# Altium schematic sheet Camera_Digital.SchDoc: Camera Digital
size A2; DrawnBy: Ian Glass; Address1: ECE Department; Address2: University of Canterbury; Address3: Christchurch 8041; Address4: New Zealand; Revision: 1; SheetNumber: 2; SheetTotal: 2; PageSetup: Record=PageOptions|CenterHorizontal=True|CenterVertical=True|PrintScale=0.71|XCorrection=1.00|YCorrection=1.00|PrintKind=1|BorderSize=5000000|LeftOffset=0|BottomOffset=0|Orientation=2|PaperLength=1000|PaperWidth=1000|Scale=100|PaperSource=15|PrintQuality=600|MediaType=1|DitherType=10|PaperKind=A3|PrintScaleMode=1
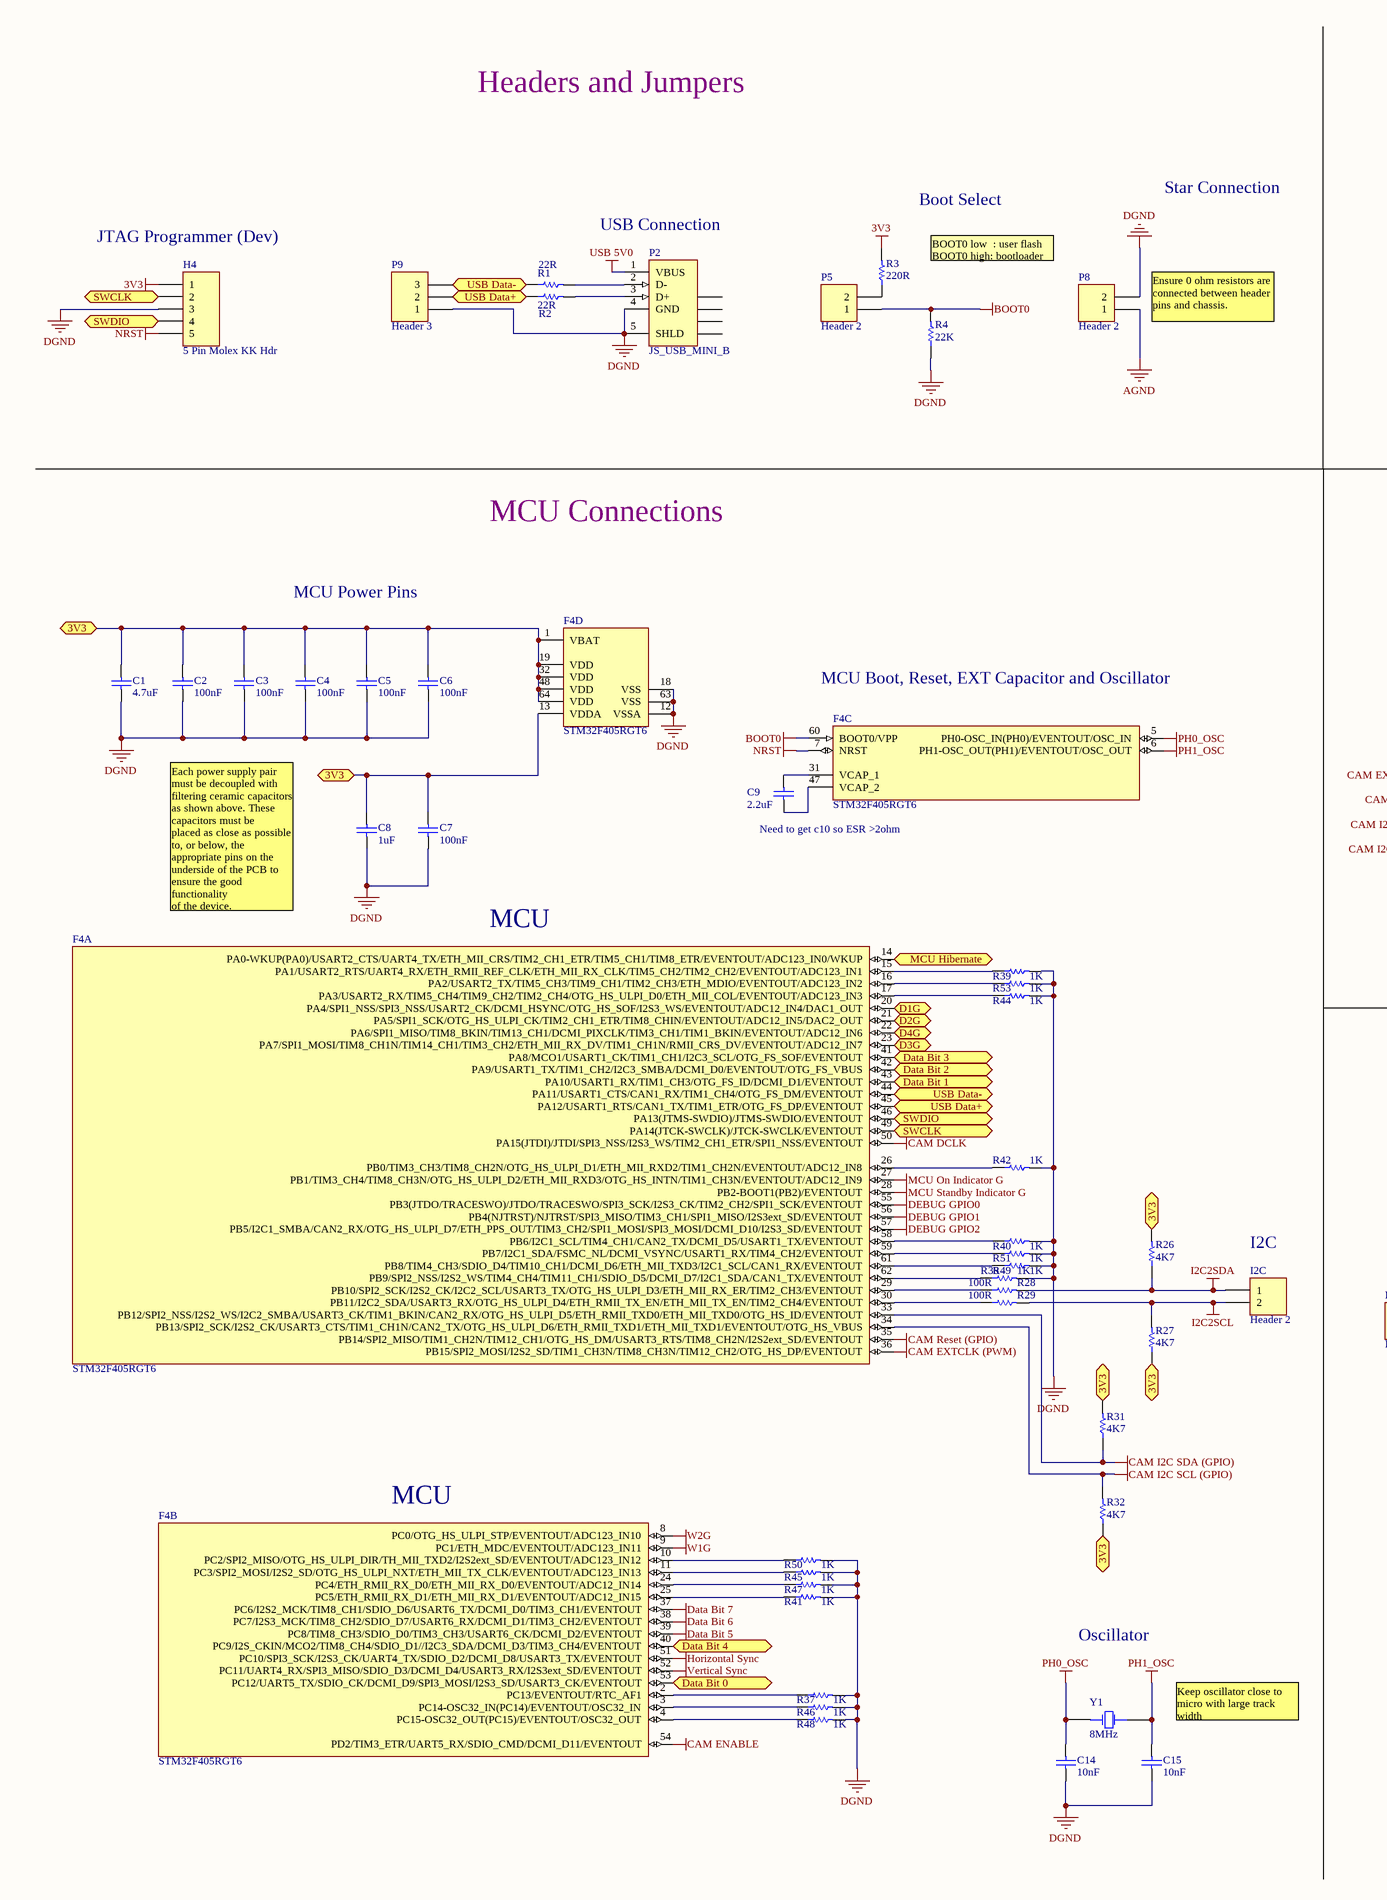
[diagram p0: Camera_Digital.SchDoc, left]
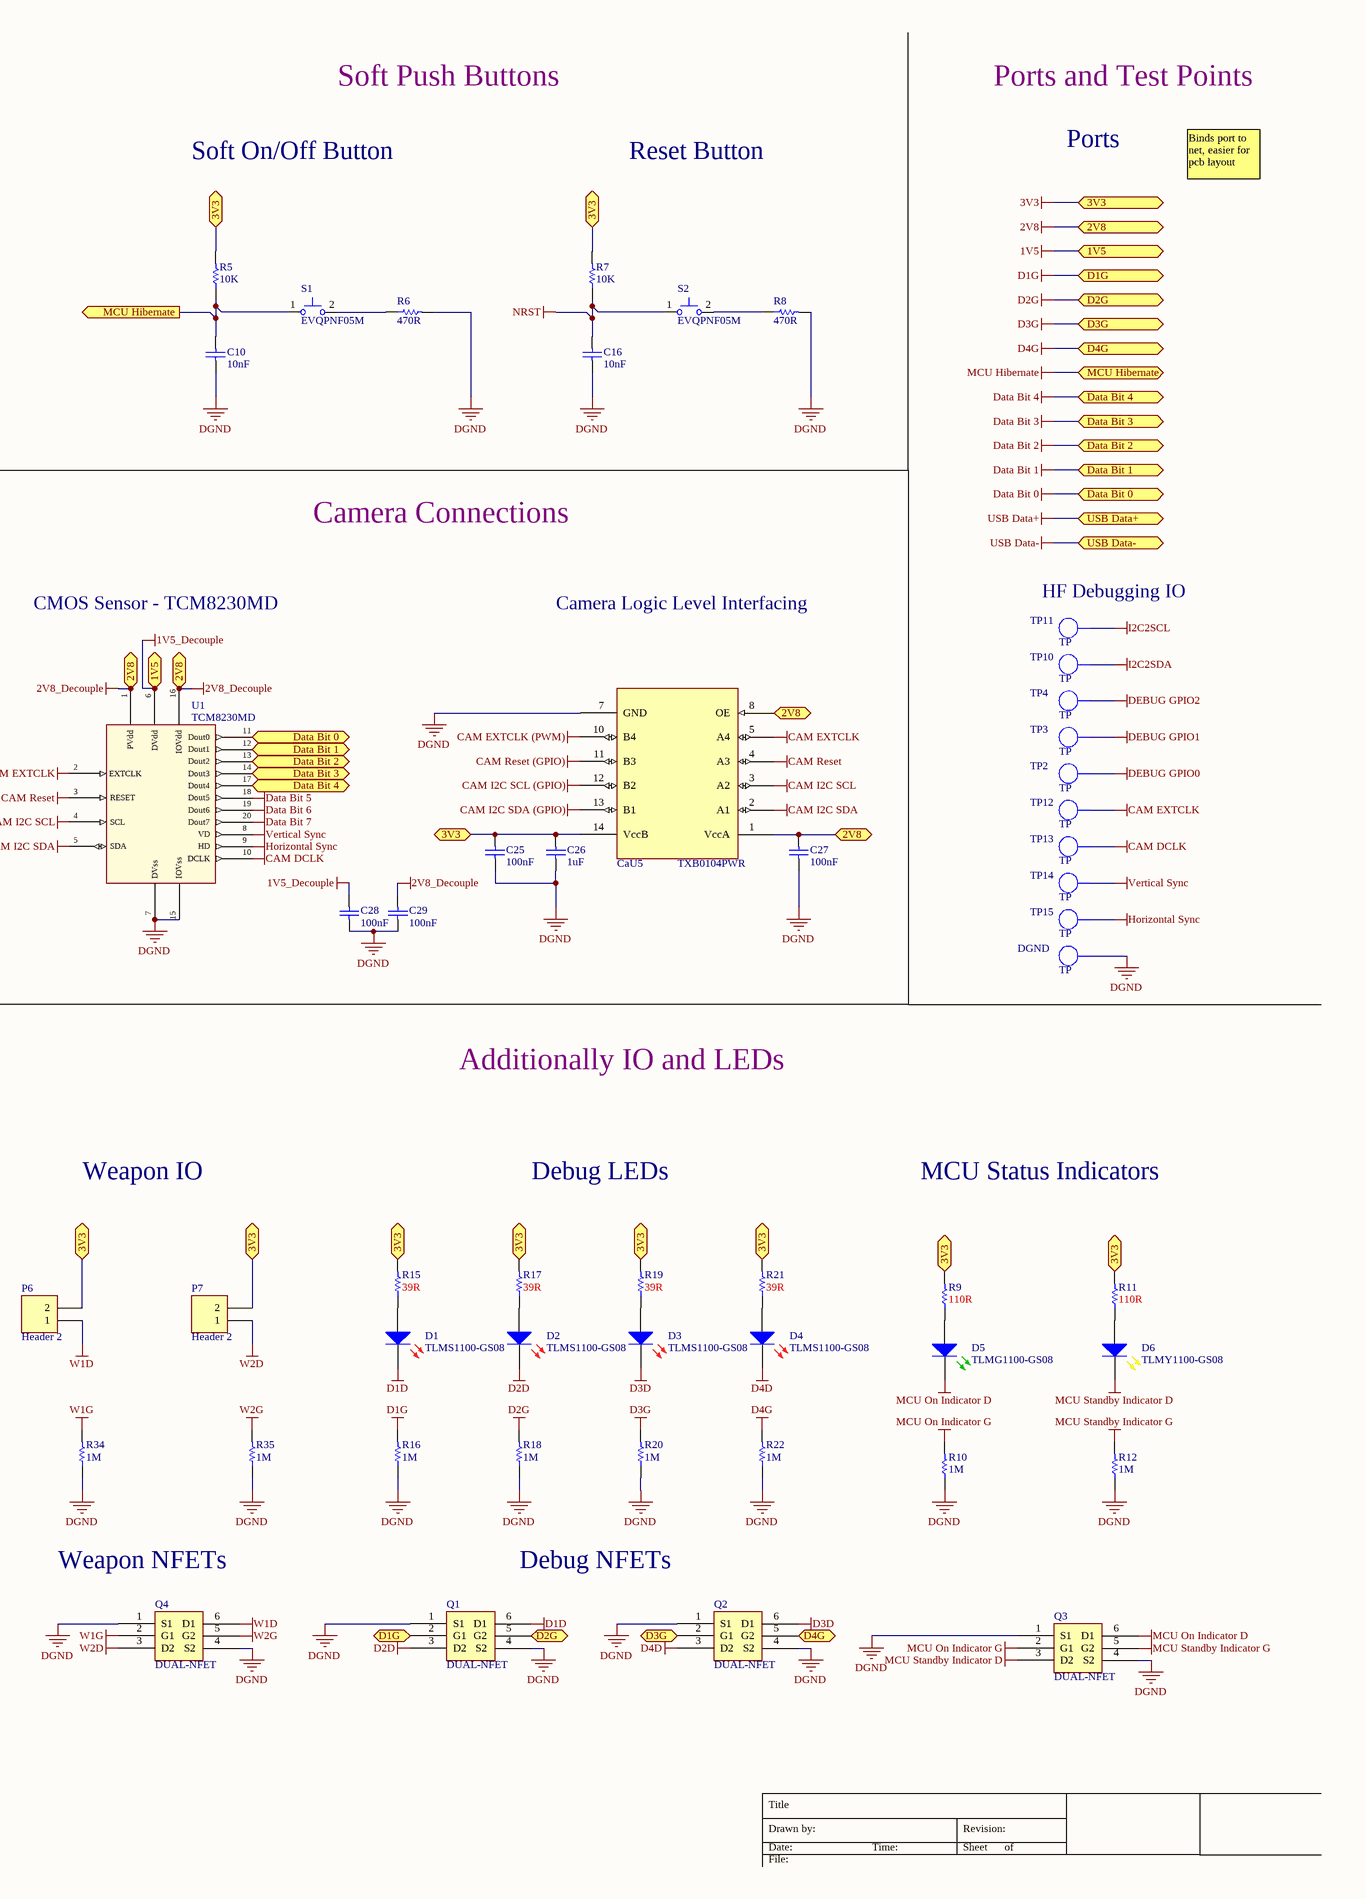
[diagram p1: Camera_Digital.SchDoc, right]

## Parts
C1  4.7uF  [CAPC2012L]
C2  100nF  [CAPC1005L]
C3  100nF  [CAPC1005L]
C4  100nF  [CAPC1005L]
C5  100nF  [CAPC1005L]
C6  100nF  [CAPC1005L]
C7  100nF  [CAPC1005L]
C8  1uF  [CAPC1608L]
C9  2.2uF  [14-1210]
C10  10nF  [CAPC1608L]
C14  10nF  [CAPC1608L]
C15  10nF  [CAPC1608L]
C16  10nF  [CAPC1608L]
C25  100nF  [CAPC1005L]
C26  1uF  [CAPC2012L]
C27  100nF  [CAPC2012L]
C28  100nF  [CAPC1005L]
C29  100nF  [CAPC1005L]
CaU5  TXB0104PWR  [14-TSSOP]
D1  TLMS1100-GS08  [LED0.8X1.6]
D2  TLMS1100-GS08  [LED0.8X1.6]
D3  TLMS1100-GS08  [LED0.8X1.6]
D4  TLMS1100-GS08  [LED0.8X1.6]
D5  TLMG1100-GS08  [LED0.8X1.6]
D6  TLMY1100-GS08  [LED0.8X1.6]
DGND  TP  [TEST_POINT_3.5X2MM]  (no BOM)
F4  STM32F405RGT6  [TQFP64_V]  (parts A,B,C,D of 4)
H4  5 Pin Molex KK Hdr  [MOLEX_KK_5_HDR]
I2C  Header 2  [HDR1X2]
P2  JS_USB_MINI_B  [USB/SM0.8-6H5]
P5  Header 2  [HDR1X2]
P6  Header 2  [HDR1X2]
P7  Header 2  [HDR1X2]
P8  Header 2  [HDR1X2]
P9  Header 3  [HDR1X3]
Q1  DUAL-NFET  [SOT363-6N]
Q2  DUAL-NFET  [SOT363-6N]
Q3  DUAL-NFET  [SOT363-6N]
Q4  DUAL-NFET  [SOT363-6N]
R1  22R  [RESC1608L]
R2  22R  [RESC1608L]
R3  220R  [RESC1608L]
R4  22K  [RESC1608L]
R5  10K  [RESC1608L]
R6  470R  [RESC1608L]
R7  10K  [RESC1608L]
R8  470R  [RESC1608L]
R9  110R  [RESC1608L]
R10  1M  [RESC1608L]
R11  110R  [RESC1608L]
R12  1M  [RESC1608L]
R15  39R  [RESC1608L]
R16  1M  [RESC1608L]
R17  39R  [RESC1608L]
R18  1M  [RESC1608L]
R19  39R  [RESC1608L]
R20  1M  [RESC1608L]
R21  39R  [RESC1608L]
R22  1M  [RESC1608L]
R26  4K7  [RESC1608L]
R27  4K7  [RESC1608L]
R28  100R  [RESC1608L]
R29  100R  [RESC1608L]
R31  4K7  [RESC1608L]
R32  4K7  [RESC1608L]
R34  1M  [RESC1608L]
R35  1M  [RESC1608L]
R37  1K  [RESC1608L]
R38  1K  [RESC1608L]
R39  1K  [RESC1608L]
R40  1K  [RESC1608L]
R41  1K  [RESC1608L]
R42  1K  [RESC1608L]
R44  1K  [RESC1608L]
R45  1K  [RESC1608L]
R46  1K  [RESC1608L]
R47  1K  [RESC1608L]
R48  1K  [RESC1608L]
R49  1K  [RESC1608L]
R50  1K  [RESC1608L]
R51  1K  [RESC1608L]
R53  1K  [RESC1608L]
S1  EVQPNF05M  [EVQPNF05M]
S2  EVQPNF05M  [EVQPNF05M]
TP2  TP  [TEST_POINT_3.5X2MM]  (no BOM)
TP3  TP  [TEST_POINT_3.5X2MM]  (no BOM)
TP4  TP  [TEST_POINT_3.5X2MM]  (no BOM)
TP10  TP  [TEST_POINT_3.5X2MM]  (no BOM)
TP11  TP  [TEST_POINT_3.5X2MM]  (no BOM)
TP12  TP  [TEST_POINT_3.5X2MM]  (no BOM)
TP13  TP  [TEST_POINT_3.5X2MM]  (no BOM)
TP14  TP  [TEST_POINT_3.5X2MM]  (no BOM)
TP15  TP  [TEST_POINT_3.5X2MM]  (no BOM)
U1  TCM8230MD  [TCM8230MD]
Y1  8MHz  [HC49/4h_SMX]

## Ports
1V5, 2V8, 3V3, D1G, D1G (bidir), D2G, D2G (bidir), D3G, D3G (bidir), D4G, D4G (bidir), Data Bit 0, Data Bit 0 (in), Data Bit 0 (out), Data Bit 1, Data Bit 1 (in), Data Bit 1 (out), Data Bit 2, Data Bit 2 (in), Data Bit 2 (out), Data Bit 3, Data Bit 3 (in), Data Bit 3 (out), Data Bit 4, Data Bit 4 (in), Data Bit 4 (out), MCU Hibernate, MCU Hibernate (in), MCU Hibernate (out), SWCLK (bidir), SWDIO (bidir), USB Data+, USB Data+ (bidir), USB Data-, USB Data- (bidir)

## Nets
1V5: C28.1 U1.6(DVdd) ; port 1V5  [also labelled 1V5_Decouple]
2V8: C27.1 C29.1 CaU5.1(VccA) CaU5.8(OE) U1.1(PVdd) U1.16(IOVdd) ; port 2V8  [also labelled 2V8_Decouple]
3V3: C1.2 C2.2 C3.2 C4.2 C5.2 C6.2 C7.2 C8.2 C25.2 C26.1 CaU5.14(VccB) F4.1(VBAT) F4.13(VDDA) F4.19(VDD) F4.32(VDD) F4.48(VDD) F4.64(VDD) H4.1 P6.2 P7.2 R3.2 R5.2 R7.2 R9.2 R11.2 R15.2 R17.2 R19.2 R21.2 R26.2 R27.1 R31.2 R32.1 ; port 3V3
AGND: P8.1
BOOT0: F4.60(BOOT0/VPP) P5.1 R4.2
CAM DCLK: F4.50(PA15(JTDI)/JTDI/SPI3_NSS/I2S3_WS/TIM2_CH1_ETR/SPI1_NSS/EVENTOUT) TP13.1 U1.10(DCLK)
CAM ENABLE: F4.54(PD2/TIM3_ETR/UART5_RX/SDIO_CMD/DCMI_D11/EVENTOUT)
CAM EXTCLK: CaU5.5(A4) TP12.1 U1.2(EXTCLK)
CAM EXTCLK (PWM): CaU5.10(B4) F4.36(PB15/SPI2_MOSI/I2S2_SD/TIM1_CH3N/TIM8_CH3N/TIM12_CH2/OTG_HS_DP/EVENTOUT)
CAM I2C SCL: CaU5.3(A2) U1.4(SCL)
CAM I2C SCL (GPIO): CaU5.12(B2) F4.34(PB13/SPI2_SCK/I2S2_CK/USART3_CTS/TIM1_CH1N/CAN2_TX/OTG_HS_ULPI_D6/ETH_RMII_TXD1/ETH_MII_TXD1/EVENTOUT/OTG_HS_VBUS) R32.2
CAM I2C SDA: CaU5.2(A1) U1.5(SDA)
CAM I2C SDA (GPIO): CaU5.13(B1) F4.33(PB12/SPI2_NSS/I2S2_WS/I2C2_SMBA/USART3_CK/TIM1_BKIN/CAN2_RX/OTG_HS_ULPI_D5/ETH_RMII_TXD0/ETH_MII_TXD0/OTG_HS_ID/EVENTOUT) R31.1
CAM Reset: CaU5.4(A3) U1.3(RESET)
CAM Reset (GPIO): CaU5.11(B3) F4.35(PB14/SPI2_MISO/TIM1_CH2N/TIM12_CH1/OTG_HS_DM/USART3_RTS/TIM8_CH2N/I2S2ext_SD/EVENTOUT)
D1D: D1.2(K) Q1.6(D1)
D1G: F4.20(PA4/SPI1_NSS/SPI3_NSS/USART2_CK/DCMI_HSYNC/OTG_HS_SOF/I2S3_WS/EVENTOUT/ADC12_IN4/DAC1_OUT) Q1.2(G1) R16.2 ; port D1G
D2D: D2.2(K) Q1.3(D2)
D2G: F4.21(PA5/SPI1_SCK/OTG_HS_ULPI_CK/TIM2_CH1_ETR/TIM8_CHIN/EVENTOUT/ADC12_IN5/DAC2_OUT) Q1.5(G2) R18.2 ; port D2G
D3D: D3.2(K) Q2.6(D1)
D3G: F4.23(PA7/SPI1_MOSI/TIM8_CH1N/TIM14_CH1/TIM3_CH2/ETH_MII_RX_DV/TIM1_CH1N/RMII_CRS_DV/EVENTOUT/ADC12_IN7) Q2.2(G1) R20.2 ; port D3G
D4D: D4.2(K) Q2.3(D2)
D4G: F4.22(PA6/SPI1_MISO/TIM8_BKIN/TIM13_CH1/DCMI_PIXCLK/TIM3_CH1/TIM1_BKIN/EVENTOUT/ADC12_IN6) Q2.5(G2) R22.2 ; port D4G
Data Bit 0: F4.53(PC12/UART5_TX/SDIO_CK/DCMI_D9/SPI3_MOSI/I2S3_SD/USART3_CK/EVENTOUT) U1.11(Dout0) ; port Data Bit 0
Data Bit 1: F4.43(PA10/USART1_RX/TIM1_CH3/OTG_FS_ID/DCMI_D1/EVENTOUT) U1.12(Dout1) ; port Data Bit 1
Data Bit 2: F4.42(PA9/USART1_TX/TIM1_CH2/I2C3_SMBA/DCMI_D0/EVENTOUT/OTG_FS_VBUS) U1.13(Dout2) ; port Data Bit 2
Data Bit 3: F4.41(PA8/MCO1/USART1_CK/TIM1_CH1/I2C3_SCL/OTG_FS_SOF/EVENTOUT) U1.14(Dout3) ; port Data Bit 3
Data Bit 4: F4.40(PC9/I2S_CKIN/MCO2/TIM8_CH4/SDIO_D1//I2C3_SDA/DCMI_D3/TIM3_CH4/EVENTOUT) U1.17(Dout4) ; port Data Bit 4
Data Bit 5: F4.39(PC8/TIM8_CH3/SDIO_D0/TIM3_CH3/USART6_CK/DCMI_D2/EVENTOUT) U1.18(Dout5)
Data Bit 6: F4.38(PC7/I2S3_MCK/TIM8_CH2/SDIO_D7/USART6_RX/DCMI_D1/TIM3_CH2/EVENTOUT) U1.19(Dout6)
Data Bit 7: F4.37(PC6/I2S2_MCK/TIM8_CH1/SDIO_D6/USART6_TX/DCMI_D0/TIM3_CH1/EVENTOUT) U1.20(Dout7)
DEBUG GPIO0: F4.55(PB3(JTDO/TRACESWO)/JTDO/TRACESWO/SPI3_SCK/I2S3_CK/TIM2_CH2/SPI1_SCK/EVENTOUT) TP2.1
DEBUG GPIO1: F4.56(PB4(NJTRST)/NJTRST/SPI3_MISO/TIM3_CH1/SPI1_MISO/I2S3ext_SD/EVENTOUT) TP3.1
DEBUG GPIO2: F4.57(PB5/I2C1_SMBA/CAN2_RX/OTG_HS_ULPI_D7/ETH_PPS_OUT/TIM3_CH2/SPI1_MOSI/SPI3_MOSI/DCMI_D10/I2S3_SD/EVENTOUT) TP4.1
DGND: C1.1 C2.1 C3.1 C4.1 C5.1 C6.1 C7.1 C8.1 C10.1 C14.1 C15.1 C16.1 C25.1 C26.2 C27.2 C28.2 C29.2 CaU5.7(GND) DGND.1 F4.12(VSSA) F4.18(VSS) F4.63(VSS) H4.3 P2.4(GND) P2.5(SHLD) P8.2 P9.1 Q1.1(S1) Q1.4(S2) Q2.1(S1) Q2.4(S2) Q3.1(S1) Q3.4(S2) Q4.1(S1) Q4.4(S2) R4.1 R6.2 R8.2 R10.1 R12.1 R16.1 R18.1 R20.1 R22.1 R34.1 R35.1 R37.2 R38.2 R39.2 R40.2 R41.2 R42.2 R44.2 R45.2 R46.2 R47.2 R48.2 R49.2 R50.2 R51.2 R53.2 U1.7(DVss) U1.15(IOVss)
Horizontal Sync: F4.51(PC10/SPI3_SCK/I2S3_CK/UART4_TX/SDIO_D2/DCMI_D8/USART3_TX/EVENTOUT) TP15.1 U1.9(HD)
I2C2SCL: I2C.2 R27.2 R29.2 TP11.1
I2C2SDA: I2C.1 R26.1 R28.2 TP10.1
MCU Hibernate: C10.2 F4.14(PA0-WKUP(PA0)/USART2_CTS/UART4_TX/ETH_MII_CRS/TIM2_CH1_ETR/TIM5_CH1/TIM8_ETR/EVENTOUT/ADC123_IN0/WKUP) R5.1 S1.1 ; port MCU Hibernate
MCU On Indicator D: D5.2(K) Q3.6(D1)
MCU On Indicator G: F4.27(PB1/TIM3_CH4/TIM8_CH3N/OTG_HS_ULPI_D2/ETH_MII_RXD3/OTG_HS_INTN/TIM1_CH3N/EVENTOUT/ADC12_IN9) Q3.2(G1) R10.2
MCU Standby Indicator D: D6.2(K) Q3.3(D2)
MCU Standby Indicator G: F4.28(PB2-BOOT1(PB2)/EVENTOUT) Q3.5(G2) R12.2
NRST: C16.2 F4.7(NRST) H4.5 R7.1 S2.1
PH0_OSC: C14.2 F4.5(PH0-OSC_IN(PH0)/EVENTOUT/OSC_IN) Y1.1(OSC1)
PH1_OSC: C15.2 F4.6(PH1-OSC_OUT(PH1)/EVENTOUT/OSC_OUT) Y1.2(OSC2)
USB 5V0: P2.1(VBUS)
USB Data+: F4.45(PA12/USART1_RTS/CAN1_TX/TIM1_ETR/OTG_FS_DP/EVENTOUT) P9.2 R2.1 ; port USB Data+
USB Data-: F4.44(PA11/USART1_CTS/CAN1_RX/TIM1_CH4/OTG_FS_DM/EVENTOUT) P9.3 R1.1 ; port USB Data-
Vertical Sync: F4.52(PC11/UART4_RX/SPI3_MISO/SDIO_D3/DCMI_D4/USART3_RX/I2S3ext_SD/EVENTOUT) TP14.1 U1.8(VD)
W1D: P6.1 Q4.6(D1)
W1G: F4.9(PC1/ETH_MDC/EVENTOUT/ADC123_IN11) Q4.2(G1) R34.2
W2D: P7.1 Q4.3(D2)
W2G: F4.8(PC0/OTG_HS_ULPI_STP/EVENTOUT/ADC123_IN10) Q4.5(G2) R35.2
SWCLK: F4.49(PA14(JTCK-SWCLK)/JTCK-SWCLK/EVENTOUT) H4.2 ; port SWCLK
SWDIO: F4.46(PA13(JTMS-SWDIO)/JTMS-SWDIO/EVENTOUT) H4.4 ; port SWDIO
NetC9_1: C9.1 F4.31(VCAP_1)
NetC9_2: C9.2 F4.47(VCAP_2)
NetD1_1: D1.1(A) R15.1
NetD2_1: D2.1(A) R17.1
NetD3_1: D3.1(A) R19.1
NetD4_1: D4.1(A) R21.1
NetD5_1: D5.1(A) R9.1
NetD6_1: D6.1(A) R11.1
NetF4_2: F4.2(PC13/EVENTOUT/RTC_AF1) R37.1
NetF4_3: F4.3(PC14-OSC32_IN(PC14)/EVENTOUT/OSC32_IN) R46.1
NetF4_4: F4.4(PC15-OSC32_OUT(PC15)/EVENTOUT/OSC32_OUT) R48.1
NetF4_10: F4.10(PC2/SPI2_MISO/OTG_HS_ULPI_DIR/TH_MII_TXD2/I2S2ext_SD/EVENTOUT/ADC123_IN12) R50.1
NetF4_11: F4.11(PC3/SPI2_MOSI/I2S2_SD/OTG_HS_ULPI_NXT/ETH_MII_TX_CLK/EVENTOUT/ADC123_IN13) R45.1
NetF4_15: F4.15(PA1/USART2_RTS/UART4_RX/ETH_RMII_REF_CLK/ETH_MII_RX_CLK/TIM5_CH2/TIM2_CH2/EVENTOUT/ADC123_IN1) R39.1
NetF4_16: F4.16(PA2/USART2_TX/TIM5_CH3/TIM9_CH1/TIM2_CH3/ETH_MDIO/EVENTOUT/ADC123_IN2) R53.1
NetF4_17: F4.17(PA3/USART2_RX/TIM5_CH4/TIM9_CH2/TIM2_CH4/OTG_HS_ULPI_D0/ETH_MII_COL/EVENTOUT/ADC123_IN3) R44.1
NetF4_24: F4.24(PC4/ETH_RMII_RX_D0/ETH_MII_RX_D0/EVENTOUT/ADC12_IN14) R47.1
NetF4_25: F4.25(PC5/ETH_RMII_RX_D1/ETH_MII_RX_D1/EVENTOUT/ADC12_IN15) R41.1
NetF4_26: F4.26(PB0/TIM3_CH3/TIM8_CH2N/OTG_HS_ULPI_D1/ETH_MII_RXD2/TIM1_CH2N/EVENTOUT/ADC12_IN8) R42.1
NetF4_29: F4.29(PB10/SPI2_SCK/I2S2_CK/I2C2_SCL/USART3_TX/OTG_HS_ULPI_D3/ETH_MII_RX_ER/TIM2_CH3/EVENTOUT) R28.1
NetF4_30: F4.30(PB11/I2C2_SDA/USART3_RX/OTG_HS_ULPI_D4/ETH_RMII_TX_EN/ETH_MII_TX_EN/TIM2_CH4/EVENTOUT) R29.1
NetF4_58: F4.58(PB6/I2C1_SCL/TIM4_CH1/CAN2_TX/DCMI_D5/USART1_TX/EVENTOUT) R40.1
NetF4_59: F4.59(PB7/I2C1_SDA/FSMC_NL/DCMI_VSYNC/USART1_RX/TIM4_CH2/EVENTOUT) R51.1
NetF4_61: F4.61(PB8/TIM4_CH3/SDIO_D4/TIM10_CH1/DCMI_D6/ETH_MII_TXD3/I2C1_SCL/CAN1_RX/EVENTOUT) R49.1
NetF4_62: F4.62(PB9/SPI2_NSS/I2S2_WS/TIM4_CH4/TIM11_CH1/SDIO_D5/DCMI_D7/I2C1_SDA/CAN1_TX/EVENTOUT) R38.1
NetP2_2: P2.2(D-) R1.2
NetP2_3: P2.3(D+) R2.2
NetP5_2: P5.2 R3.1
NetR6_1: R6.1 S1.2
NetR8_1: R8.1 S2.2

Not connected (* = marked no-connect by the designer): P2 6(SHLD) 7(SHLD) 8(SHLD) 9(SHLD)

## Notes on the sheet
- Headers and Jumpers
- Soft Push Buttons
- Ports and Test Points
- Soft On/Off Button
- Reset Button
- Ports
- Boot Select
- Star Connection
- Binds port to net, easier for pcb layout
- (near H4) JTAG Programmer (Dev)
- (near P2) USB Connection
- BOOT0 low  : user flash
  BOOT0 high: bootloader
- (near P8) Ensure 0 ohm resistors are connected between header pins and chassis.
- MCU Connections
- Camera Connections
- MCU Power Pins
- CMOS Sensor - TCM8230MD
- Camera Logic Level Interfacing
- (near TP11) HF Debugging IO
- MCU Boot, Reset, EXT Capacitor and Oscillator
- Need to get c10 so ESR >2ohm
- Each power supply pair must be decoupled with filtering ceramic capacitors as shown above. These capacitors must be
  placed as close as possible to, or below, the appropriate pins on the underside of the PCB to ensure the good functionality
  of the device.
- MCU
- Additionally IO and LEDs
- Weapon IO
- Debug LEDs
- MCU Status Indicators
- (near I2C) I2C
- Weapon NFETs
- Debug NFETs
- Oscillator
- Keep oscillator close to micro with large track width
- Title
- Drawn by:
- Date:
- File:
- Time:
- Revision:
- Sheet
- of

## Library data of the parts
C1 = CC_4.7uF_0805: CAP CER 4.7uF Y5V -20% +80% 16V 0805; Note: Footprint corresponds to dimensions for bulk cassette packaging. This case size has tightened tolerances.; PackageReference: 0805; Code_IPC: 2012[0805]; Verify: *; Supplier: ECE Dept Stock; Storage Location: Pottle; Value: 4.7uF
C2-C7 C25 C28 C29 = CC_100nF_0402: CAP CER 100nF X7R +-10% 16V 0402; PackageReference: 0402; Code_IPC: 1005 [0402]; Verify: *; Supplier: ECE Dept Stock; Storage Location: Pottle; Value: 100nF
C8 = CC_1uF_0603: CAP CER 1uF Y5V -20% +80% 16V 0603; PackageReference: 0603; Code_IPC: 1608 [0603]; Verify: *; Supplier: ECE Dept Stock; Storage Location: Pottle; Value: 1uF
C9 C26 C27 = CC_2.2uF_0805: CAP CER 2.2uF Y5V -20% +80% 25V 0805; Note: Footprint corresponds to dimensions for bulk cassette packaging. This case size has tightened tolerances.; Code_IPC: 2012[0805]; Verify: *; Supplier: ECE Dept Stock; Storage Location: Pottle
  C9: PackageReference: 1210; Value: 2.2uF
  C26: PackageReference: 0805; Value: 1uF
  C27: PackageReference: 0805; Value: 100nF
C10 C14-C16 = CC_10nF_0603: CAP CER 10nF X7R +-10% 50V 0603; PackageReference: 0603; Code_IPC: 1608 [0603]; Verify: *; Supplier: ECE Dept Stock; Storage Location: Pottle; Value: 10nF
CaU5 = SG_TXB0104PWR: VOLT-LEVEL TRANSLATOR 14TSSOP; Manufacturer: Texas Instruments; Verify: Not Checked; Part Number: SG_TXB0104PWR; Supplier 1: Digi-Key; Supplier Part Number 1: 296-21929-1-ND; Supplier 2: Farnell; Supplier Part Number 2: 1607891; Manufacturer PN: TXB0104PWR; value: TXB0104PWR
D1-D4 = DL_TLMS1100: LED Red 0603; Lens Style/Size: Rectangle with Flat Top, 1.6mm x 0.8mm; Millicandela Rating: 63mcd; Viewing Angle: 160°; Voltage - Forward (Vf) Typ: 2.1V; Wavelength - Dominant: 633nm; Supplier 1: Farnell; Supplier 2: Digi-Key; Package / Case: 0603 (1608 Metric); Size / Dimension: 1.60mm L x 0.80mm W; Pricing: 1=0.67, 10=0.525, 25=0.4376, 100=0.359, 250=0.29912, 500=0.24852, 1000=0.18408 (NZD); Supplier Part Number 1: 1440338; Supplier Part Number 2: 751-1182-1-ND; Manufacturer Part Number: TLMS1100-GS08
D5 = DL_TLMG1100: LED Green 0603; Manufacturer: Vishay Semiconductor Opto Division; Millicandela Rating: 35mcd; Voltage - Forward (Vf) Typ: 2.1V; Viewing Angle: 160°; Wavelength - Peak: 572nm; Supplier 1: Farnell; Supplier 2: Digi-Key; Color: Green; Package / Case: 0603 (1608 Metric); Packaging: Cut Tape (CT); Size / Dimension: 1.60mm L x 0.80mm W; Pricing: 1=0.67, 10=0.525, 25=0.4376, 100=0.359, 250=0.29912, 500=0.24852, 1000=0.18408 (NZD); Supplier Part Number 1: 2293494; Supplier Part Number 2: 751-1165-1-ND; Manufacturer Part Number: TLMG1100-GS08
D6 = DL_TLMY1100: LED Yellow 0603; Manufacturer: Vishay Semiconductor Opto Division; Lens Style/Size: Rectangle with Flat Top, 1.6mm x 0.8mm; Millicandela Rating: 80mcd; Viewing Angle: 160°; Voltage - Forward (Vf) Typ: 2.1V; Wavelength - Peak: 591nm; Supplier 1: Farnell; Supplier 2: Digi-Key; Package / Case: 0603 (1608 Metric); Packaging: Cut Tape (CT); Size / Dimension: 1.60mm L x 0.80mm W; Pricing: 1=0.67, 10=0.525, 25=0.4376, 100=0.359, 250=0.29912, 500=0.24852, 1000=0.18408 (NZD); Supplier Part Number 1: 2103887; Supplier Part Number 2: 751-1186-1-ND; Manufacturer Part Number: TLMY1100-GS08
DGND TP2-TP4 TP10-TP15 = TP_TESTPOINT: Test-Point; LatestRevisionDate: 29 May 08; Manufacturer PN: *; Manufacturer: *; Supplier 1: Digi-Key; Supplier Part Number 1: 5016KTR-ND; Value: TP; Part Number: TP_TESTPOINT; Component Type: Standard (No BOM); Designator: TP_TESTPOINT; Footprint: TEST_POINT_4X2MM; Pin Count: 1
F4 = STM32F405RGT6: ARM Cortex-M4 32b MCU+FPU, 210DMIP, 1024 kB Flash, 192+4 kB RAM, 51 I/Os, 64-pin LQFP, -40 to +85°C, Tray; Internal RAM: 192kB; Operating Frequency (Processor Speed): 168MHz; A/D Converter: 16x12-bit; D/A Converter: 2x12-bit; 16-bit Timers (IC/OC/PWM): 12x16-bit(24/24/30); 32-bit Timer (IC/OC/PWM): 2x32-bit (8/8/8); Other Timer Functions: 2xWDG, RTC, 24-bit down counter; Serial Interface: 3xSPI/2xI2S/2xI2C/3xUSART(IrDa, ISO7816)/3xUART/1xUSB OTG FS/HS, 2xCAN/ SDIO; DatasheetVersion: rev2, Jan-2012; PackageVersion: 2012; PackageReference: TQFP64; PackageDescription: 64-Pin Low Profile Quad Flat Package, 10x10 mm Body, 0.5 mm Pitch; ComponentLink1Description: Manufacturer URL; ComponentLink1URL: http://www.st.com/; ComponentLink2Description: STM32F405/7 Datasheet; ComponentLink2URL: http://www.st.com/internet/com/TECHNICAL_RESOURCES/TECHNICAL_LITERATURE/DATASHEET/DM00037051.pdf; ComponentLink3Description: STM32F4 Web Page; ComponentLink3URL: http://www.st.com/internet/mcu/subclass/1521.jsp
H4 = JA_MOLEX_KK_5POS: CONN HEADER 5POS 2.54mm VERT_Thru Hole; Manufacturer: Molex; Manufacturer PN: 22-23-2051; Supplier 1: ECE Dept Store; Value: 5 Pin Molex KK Hdr
I2C P5-P8 = Header 2: Header, 2-Pin; LatestRevisionDate: 17-Jul-2002; LatestRevisionNote: Re-released for DXP Platform.; Publisher: Altium Limited
P2 = JS_USB_MINI_B_SMT: USB 2.0, Right Angle, SMT, B Type, Receptacle, 5 Position,; Manufacturer: FCI; Manufacturer PN: 10033526-N3212MLF; Supplier 1: Farnell; Supplier Part Number 1: 1824416; Supplier 2: ECE Stock
P9 = Header 3: Header, 3-Pin; LatestRevisionDate: 17-Jul-2002; LatestRevisionNote: Re-released for DXP Platform.; Publisher: Altium Limited
R1 R2 = RS_22R: RES 22 OHM 1/10W 5% 0603 SMD; Storage Location: ProtoPlace; Supplier: ECE Dept Stock; Value: 22R
R3 = RS_220R: RES 220 OHM 1/10W 5% 0603 SMD; Storage Location: ProtoPlace; Supplier: ECE Dept Stock; Value: 220R
R4 = RS_22K: RES 22.0K OHM 1/10W 5% 0603 SMD; Storage Location: ProtoPlace; Supplier: ECE Dept Stock; Value: 22K
R5 R7 = RS_10K: RES 10.0K OHM 1/10W 5% 0603 SMD; Storage Location: ProtoPlace; Supplier: ECE Dept Stock; Value: 10K
R6 R8 = RS_470R: RES 470 OHM 1/10W 5% 0603 SMD; Storage Location: ProtoPlace; Supplier: ECE Dept Stock; Value: 470R
R9 R11 R15 R17 R19 R21 = RS_110R: RES 110 OHM 1/10W 5% 0603 SMD; Storage Location: Red Pottel; Supplier: ECE Dept Stock
  R9 R11: Value: 110R
  R15 R17 R19 R21: Value: 39R
R10 R12 R16 R18 R20 R22 R34 R35 = RS_1M: RES 1.0M OHM 1/10W 5% 0603 SMD; Storage Location: ProtoPlace  Red Pottel; Supplier: ECE Dept Stock; Value: 1M
R26 R27 R31 R32 = RS_4K7: RES 4.7K OHM 1/10W 5% 0603 SMD; Storage Location: ProtoPlace; Supplier: ECE Dept Stock; Value: 4K7
R28 R29 = RS_100R: RES 100 OHM 1/10W 5% 0603 SMD; Storage Location: ProtoPlace; Supplier: ECE Dept Stock; Value: 100R
R37-R42 R44-R51 R53 = RS_1K: RES 1.0K OHM 1/10W 5% 0603 SMD; Storage Location: ProtoPlace; Supplier: ECE Dept Stock; Value: 1K
S1 S2 = WS_EVQPNF05M: Panasonic 6 x 3.5mm SMD Light Touch Switch Type; PackageDescription: 6.0 x 3.5 mm; Supplier 1: Farnell; Supplier Part Number 1: 2079481; Manufacturer: Panasonic; Manufacturer PN: EVQPNF05M
U1 = TCM8230MD: Toshiba I2C Camera; Manufacturer: Toshiba; Manufacturers PN: TCM8230MD; Supplier 1: Spark Fun; Supplier 1 PN: 8667
Y1 = XT_8MHz_HC49/4H: CRYSTAL 8.00 MHZ 18PF SMD; Manufacturer: Abracon Corporation; Manufacturer PN: ABLS-8.000MHZ-B2-T; Supplier 1: Digi-Key; Supplier Part Number 1: 535-9089-6-ND; Value: 8MHz